# Altium schematic sheet [17] - MECH.SchDoc
size A2; DocumentNumber: 17; SheetNumber: 17; SheetTotal: 20
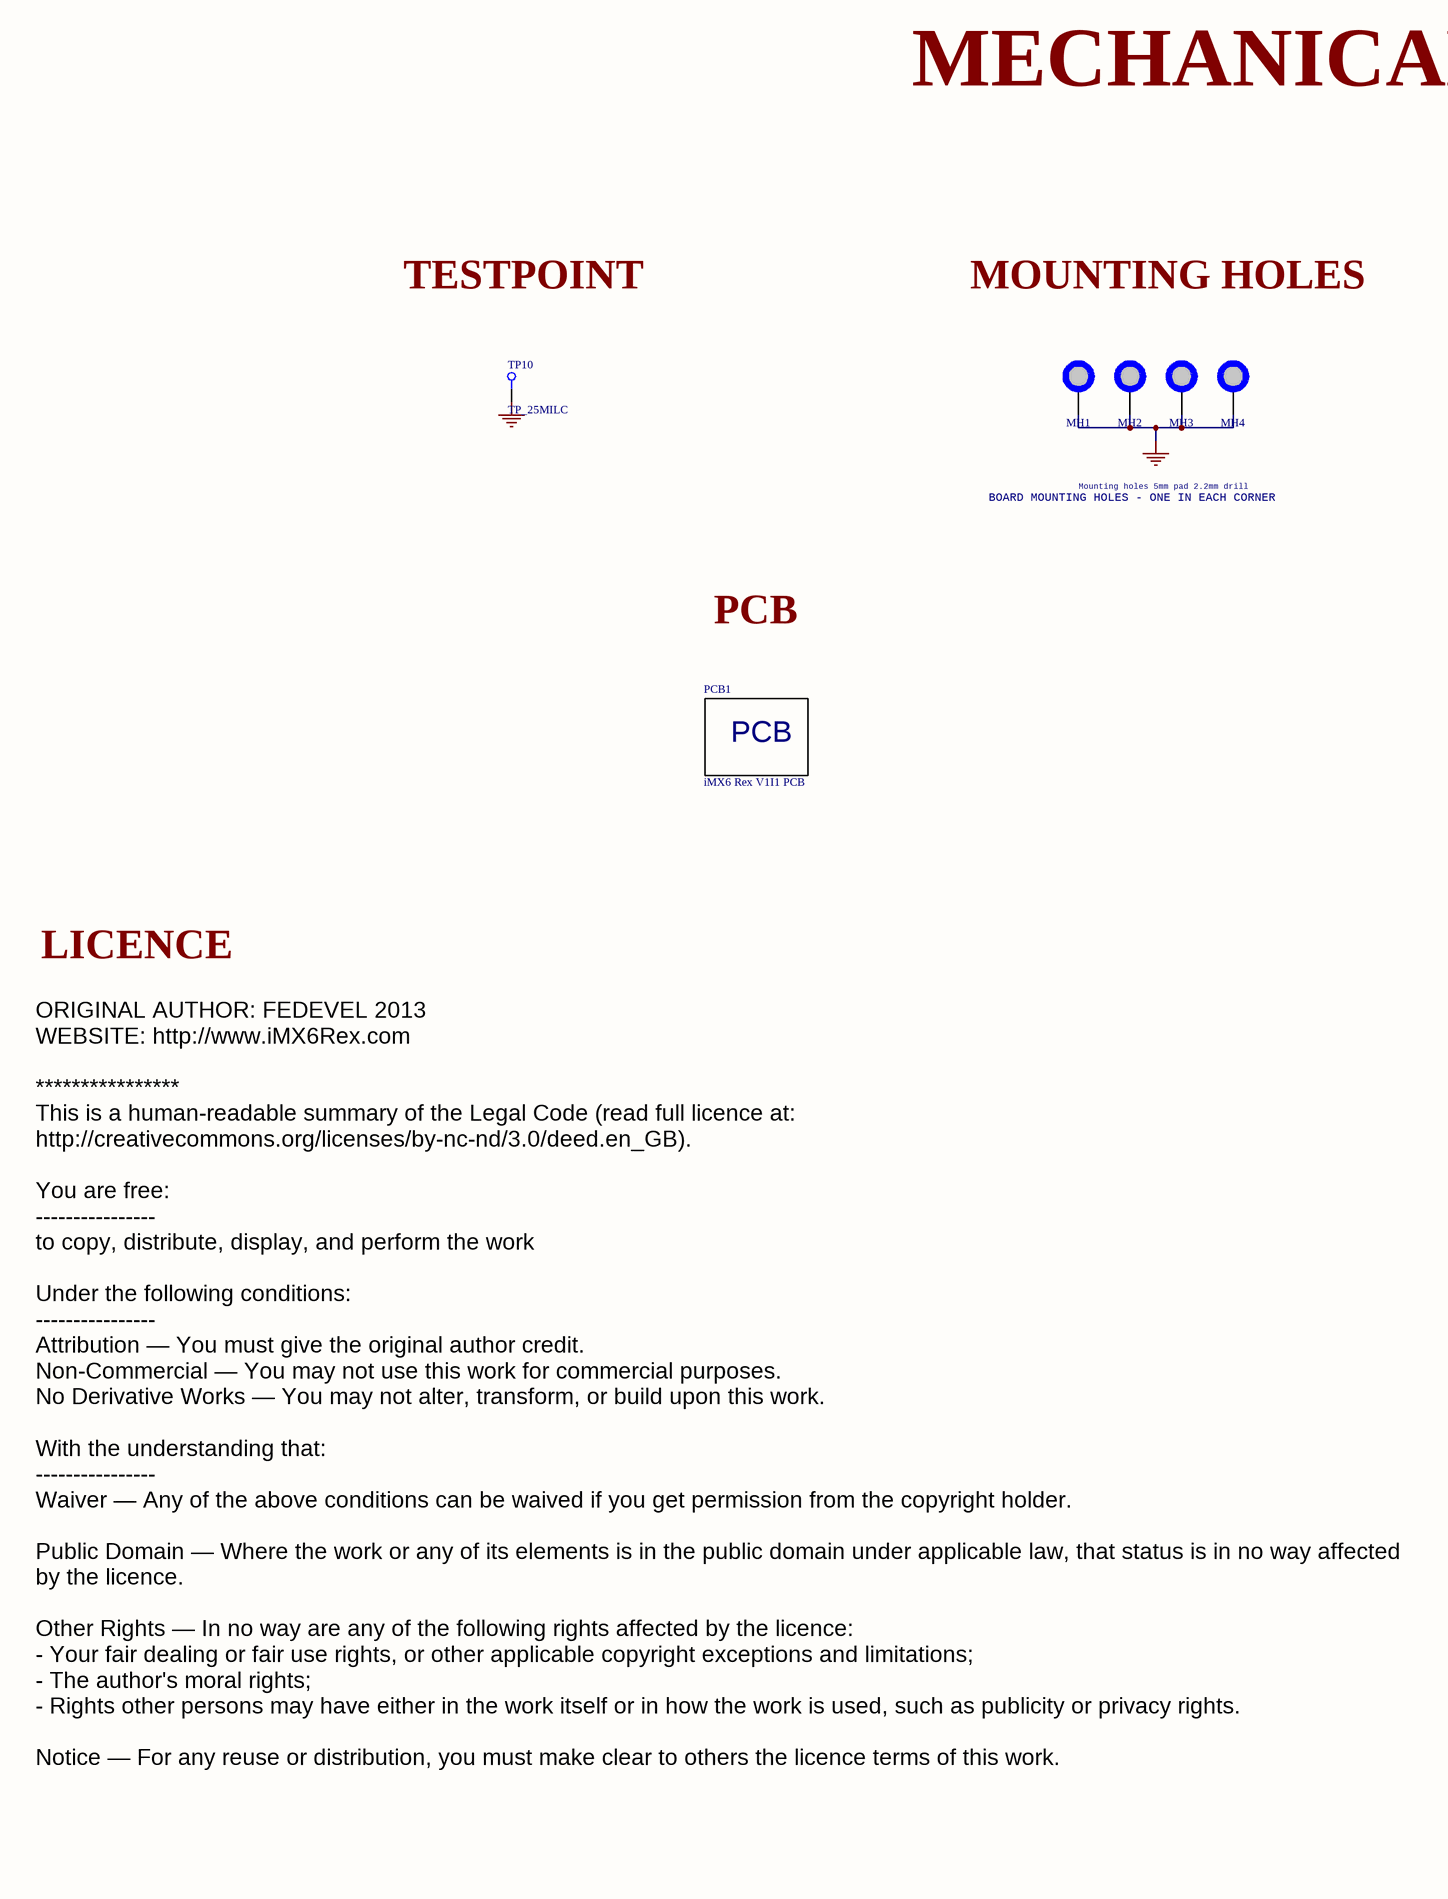
[diagram p0: [17] - MECH.SchDoc, left]
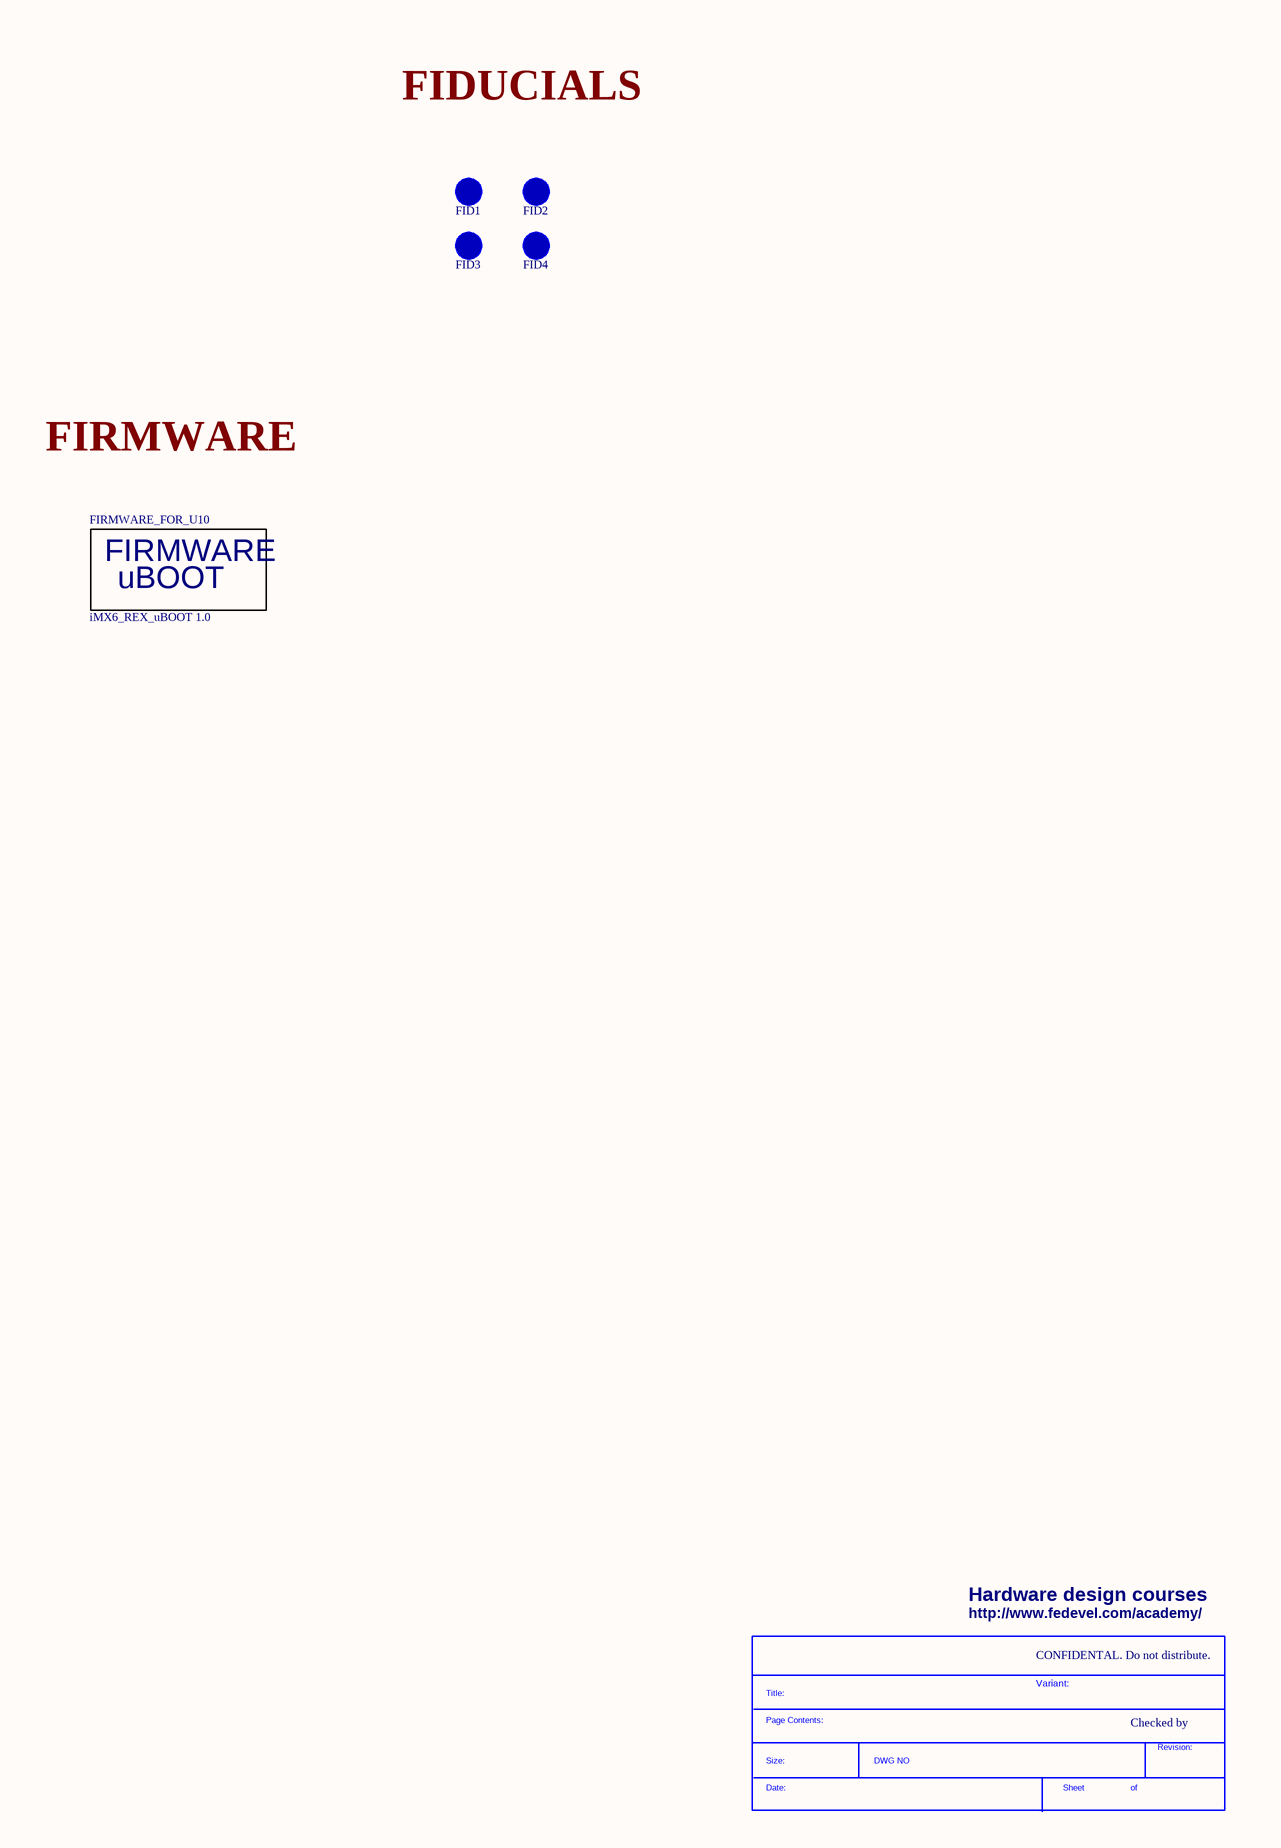
[diagram p1: [17] - MECH.SchDoc, right]

## Parts
*  SDTitleBlock  (value not drawn)  (graphical)
FID1  FID_1MM_SMALL  [FID_40X52D]  (value not drawn)  (no BOM)
FID2  FID_1MM_SMALL  [FID_40X52D]  (value not drawn)  (no BOM)
FID3  FID_1MM_SMALL  [FID_40X52D]  (value not drawn)  (no BOM)
FID4  FID_1MM_SMALL  [FID_40X52D]  (value not drawn)  (no BOM)
FIRMWARE_FOR_U10  iMX6_REX_uBOOT 1.0  (mechanical)
MH1  MH_5MMC_2.2MMD  [MH_5MMD_2.2MMD]  (value not drawn)  (no BOM)
MH2  MH_5MMC_2.2MMD  [MH_5MMD_2.2MMD]  (value not drawn)  (no BOM)
MH3  MH_5MMC_2.2MMD  [MH_5MMD_2.2MMD]  (value not drawn)  (no BOM)
MH4  MH_5MMC_2.2MMD  [MH_5MMD_2.2MMD]  (value not drawn)  (no BOM)
PCB1  iMX6 Rex V1I1 PCB  (mechanical)
TP10  TP_25MILC  [TP_25C]  (no BOM)

## Nets
GND: MH1.1 MH2.1 MH3.1 MH4.1 TP10.1

## Notes on the sheet
- MECHANICAL
- TESTPOINT
- MOUNTING HOLES
- FIDUCIALS
- BOARD MOUNTING HOLES - ONE IN EACH CORNER
- Mounting holes 5mm pad 2.2mm drill
- PCB
- FIRMWARE
- LICENCE
- Hardware design courses
- http://www.fedevel.com/academy/
- CONFIDENTAL. Do not distribute.
- ORIGINAL AUTHOR: FEDEVEL 2013
  WEBSITE: http://www.iMX6Rex.com
  ****************
  This is a human-readable summary of the Legal Code (read full licence at:
  http://creativecommons.org/licenses/by-nc-nd/3.0/deed.en_GB).
  You are free:
  ----------------
  to copy, distribute, display, and perform the work
  Under the following conditions:
  ----------------
  Attribution — You must give the original author credit.
  Non-Commercial — You may not use this work for commercial purposes.
  No Derivative Works — You may not alter, transform, or build upon this work.
  With the understanding that:
  ----------------
  Waiver — Any of the above conditions can be waived if you get permission from the copyright holder.
  Public Domain — Where the work or any of its elements is in the public domain under applicable law, that status is in no way affected by the licence.
  Other Rights — In no way are any of the following rights affected by the licence:
  - Your fair dealing or fair use rights, or other applicable copyright exceptions and limitations;
  - The author's moral rights;
  - Rights other persons may have either in the work itself or in how the work is used, such as publicity or privacy rights.
  Notice — For any reuse or distribution, you must make clear to others the licence terms of this work.
- Variant:
- Checked by
- (in symbol FIRMWARE_iMX6_Rex_uBOOT 1.0) FIRMWARE; uBOOT
- (in symbol PCB_iMX6_REX_V1I1) PCB
- (in symbol SDTitleBlock) Title:; Page Contents:; Revision:; Size:; DWG NO; Date:; Sheet; of

## Library data of the parts
FID1-FID4 = FID_1MM_SMALL: Fiducial 40mil Diameter, 52mil Mask; Supplier: Digikey
FIRMWARE_FOR_U10 = FIRMWARE_iMX6_Rex_uBOOT 1.0: .Creator: MM; Category: Firmware
MH1-MH4 = MH_5MMC_2.2MMD: Mounting Hole 5mm Diameter, 2.2mm Drill
PCB1 = PCB_iMX6_REX_V1I1: Printed Circuit Board; .Creator: MM; Category: Printed circuits board
TP10 = TP_25MILC: Test Point 25mil